# Altium schematic sheet Qbot3.SchDoc
size A3
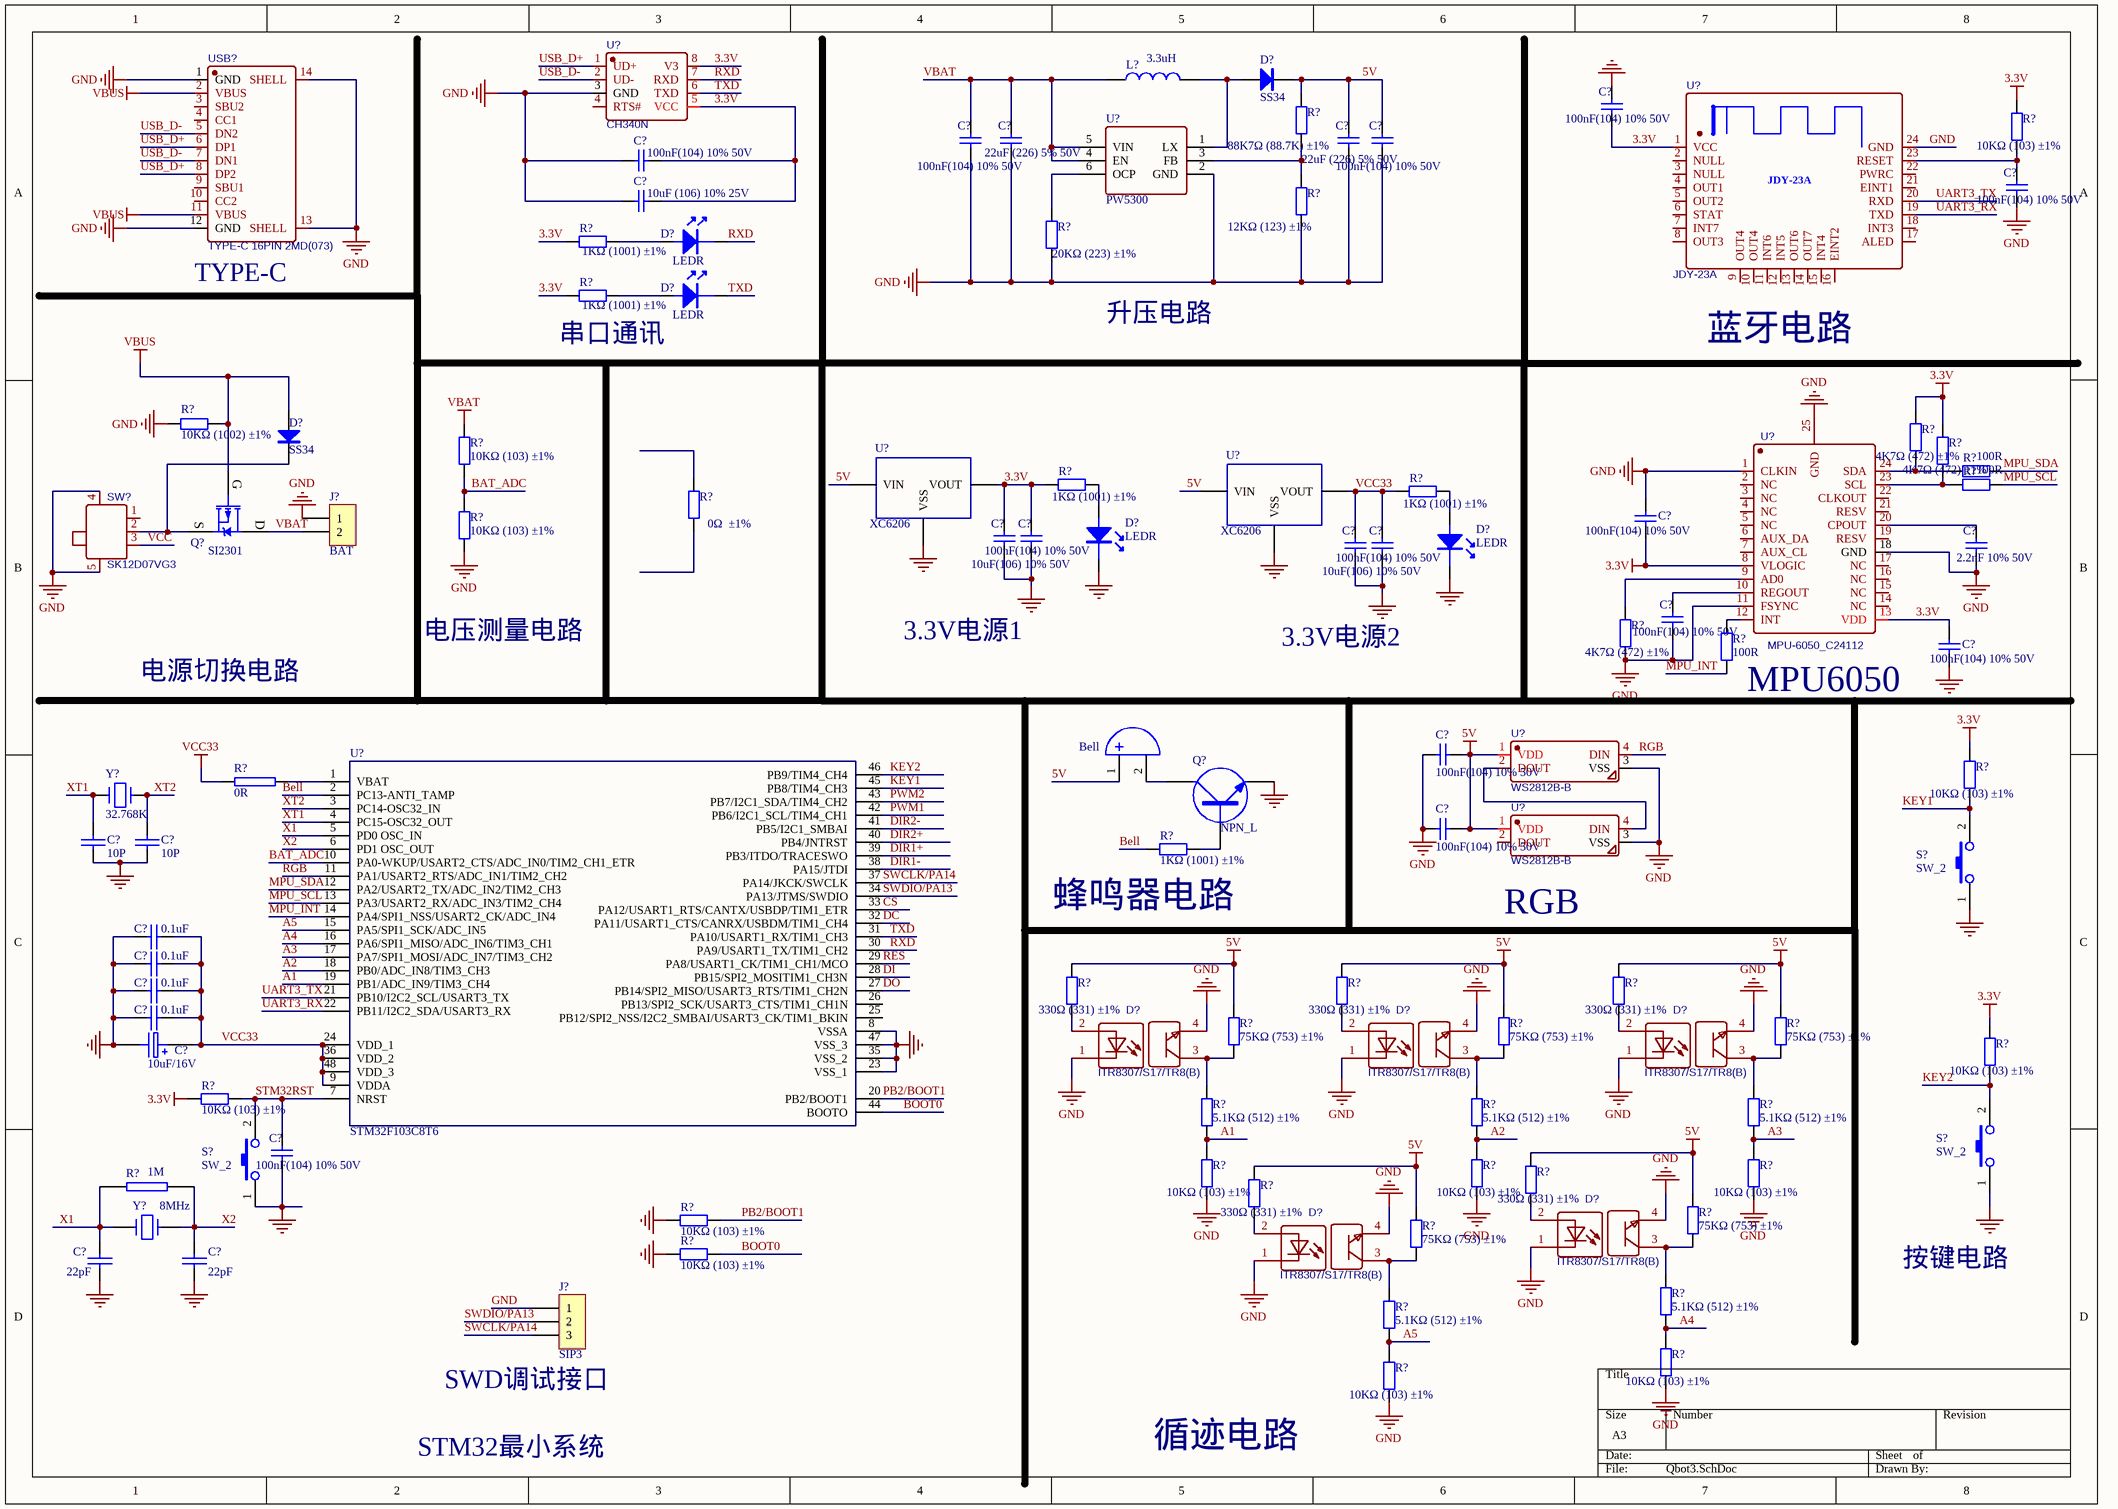
[diagram p0: Qbot3.SchDoc]

## Parts
(Parts that share a designator on the sheet are numbered #1, #2 ... from top to bottom, then left to right.)
C?#1  100nF(104) 10% 50V  [LC-0805_C]
C?#2  100nF(104) 10% 50V  [LC-0805_C]
C?#3  100nF(104) 10% 50V  [LC-0805_C]
C?#4  100nF(104) 10% 50V  [LC-0805_C]
C?#5  100nF(104) 10% 50V  [LC-0805_C]
C?#6  22uF (226) 5% 50V  [LC-0805_C]
C?#7  22uF (226) 5% 50V  [LC-0805_C]
C?#8  10uF (106) 10% 25V  [LC-0805_C]
C?#9  10uF(106) 10% 50V  [LC-0805_C]
C?#10  100nF(104) 10% 50V  [LC-0805_C]
C?#11  10uF(106) 10% 50V  [LC-0805_C]
C?#12  100nF(104) 10% 50V  [LC-0805_C]
C?#13  2.2nF 10% 50V  [LC-0805_C]
C?#14  100nF(104) 10% 50V  [LC-0805_C]
C?#15  100nF(104) 10% 50V  [LC-0805_C]
C?#16  100nF(104) 10% 50V  [LC-0805_C]
C?#17  100nF(104) 10% 50V  [LC-0805_C]
C?#18  100nF(104) 10% 50V  [LC-0805_C]
C?#19  10P  [LC-0805_C]
C?#20  10P  [LC-0805_C]
C?#21  0.1uF  [LC-0805_C]
C?#22  0.1uF  [LC-0805_C]
C?#23  0.1uF  [LC-0805_C]
C?#24  0.1uF  [LC-0805_C]
C?#25  10uF/16V  [LC-0805_C]
C?#26  100nF(104) 10% 50V  [LC-0805_C]
C?#27  22pF  [LC-0805_C]
C?#28  22pF  [LC-0805_C]
D?#1  SS34  [SMA]
D?#2  LEDR  [LED0805G]
D?#3  LEDR  [LED0805G]
D?#4  SS34  [SMA]
D?#5  LEDR  [LED0805G]
D?#6  LEDR  [LED0805G]
D?#7  ITR8307/S17/TR8(B)  [OPTO-SMD_ITR8307-S17-TR8-B-BL]
D?#8  ITR8307/S17/TR8(B)  [OPTO-SMD_ITR8307-S17-TR8-B-BL]
D?#9  ITR8307/S17/TR8(B)  [OPTO-SMD_ITR8307-S17-TR8-B-BL]
D?#10  ITR8307/S17/TR8(B)  [OPTO-SMD_ITR8307-S17-TR8-B-BL]
D?#11  ITR8307/S17/TR8(B)  [OPTO-SMD_ITR8307-S17-TR8-B-BL]
J?#1  BAT  [XH2.54-LI-2P]
J?#2  SIP3  [HDR2.54-WI-3P]
L?  3.3uH  [IND-SMD_L4.6-W4.1]
LS?  Bell  [BELL]
Q?#1  SI2301  [SOT23]
Q?#2  NPN_L  [SOT-23_S8050]
R?#1  88K7Ω (88.7K) ±1%  [LC-0805_R]
R?#2  10KΩ (103) ±1%  [LC-0805_R]
R?#3  12KΩ (123) ±1%  [LC-0805_R]
R?#4  20KΩ (223) ±1%  [LC-0805_R]
R?#5  1KΩ (1001) ±1%  [LC-0805_R]
R?#6  1KΩ (1001) ±1%  [LC-0805_R]
R?#7  10KΩ (1002) ±1%  [LC-0805_R]
R?#8  4K7Ω (472) ±1%  [LC-0805_R]
R?#9  10KΩ (103) ±1%  [LC-0805_R]
R?#10  4K7Ω (472) ±1%  [LC-0805_R]
R?#11  100R  [LC-0805_R]
R?#12  1KΩ (1001) ±1%  [LC-0805_R]
R?#13  100R  [LC-0805_R]
R?#14  1KΩ (1001) ±1%  [LC-0805_R]
R?#15  0Ω  ±1%  [LC-0805_R]
R?#16  10KΩ (103) ±1%  [LC-0805_R]
R?#17  4K7Ω (472) ±1%  [LC-0805_R]
R?#18  100R  [LC-0805_R]
R?#19  0R  [LC-0805_R]
R?#20  10KΩ (103) ±1%  [LC-0805_R]
R?#21  1KΩ (1001) ±1%  [LC-0805_R]
R?#22  330Ω (331) ±1%  [LC-0805_R]
R?#23  330Ω (331) ±1%  [LC-0805_R]
R?#24  330Ω (331) ±1%  [LC-0805_R]
R?#25  75KΩ (753) ±1%  [LC-0805_R]
R?#26  75KΩ (753) ±1%  [LC-0805_R]
R?#27  75KΩ (753) ±1%  [LC-0805_R]
R?#28  10KΩ (103) ±1%  [LC-0805_R]
R?#29  10KΩ (103) ±1%  [LC-0805_R]
R?#30  5.1KΩ (512) ±1%  [LC-0805_R]
R?#31  5.1KΩ (512) ±1%  [LC-0805_R]
R?#32  5.1KΩ (512) ±1%  [LC-0805_R]
R?#33  1M  [LC-0805_R]
R?#34  10KΩ (103) ±1%  [LC-0805_R]
R?#35  10KΩ (103) ±1%  [LC-0805_R]
R?#36  10KΩ (103) ±1%  [LC-0805_R]
R?#37  330Ω (331) ±1%  [LC-0805_R]
R?#38  330Ω (331) ±1%  [LC-0805_R]
R?#39  10KΩ (103) ±1%  [LC-0805_R]
R?#40  75KΩ (753) ±1%  [LC-0805_R]
R?#41  75KΩ (753) ±1%  [LC-0805_R]
R?#42  10KΩ (103) ±1%  [LC-0805_R]
R?#43  5.1KΩ (512) ±1%  [LC-0805_R]
R?#44  5.1KΩ (512) ±1%  [LC-0805_R]
R?#45  10KΩ (103) ±1%  [LC-0805_R]
R?#46  10KΩ (103) ±1%  [LC-0805_R]
S?#1  SW_2  [TSW SMD-3*6*2.5]
S?#2  SW_2  [TSW SMD-3*6*2.5]
S?#3  SW_2  [TSW SMD-3*6*2.5]
SW?  SK12D07VG3  [SW-TH_SK-12D07-VG3]
U?#1  CH340N  [SOP8]
U?#2  PW5300  [SOT23-6L]
U?#3  JDY-23A  [JDY-23A]
U?#4  XC6206  [SOT-23_TL431]
U?#5  XC6206  [SOT-23_TL431]
U?#6  MPU-6050_C24112  [QFN24]
U?#7  STM32F103C8T6  [STM32F103C8T6_LQFP48]
U?#8  WS2812B-B  [LED-SMD_4P-L5.0-W5.0-TL_WS2812B-B]
U?#9  WS2812B-B  [LED-SMD_4P-L5.0-W5.0-TL_WS2812B-B]
USB?  TYPE-C 16PIN 2MD(073)  [USB-C-SMD_TYPE-C-6PIN-2MD-073]
Y?#1  32.768K  [OSC-3x10-WI-A]
Y?#2  8MHz  [OSC HC-49S]

## Nets
3.3V: C?#1.2 C?#5.1 C?#8.1 C?#9.1 C?#10.1 C?#14.1 C?#16.2 R?#2.1 R?#5.1 R?#6.1 R?#8.1 R?#10.1 R?#12.1 R?#20.1 R?#28.1 R?#29.2 U?#1.5(VCC) U?#1.8(V3) U?#3.1(VCC) U?#4.2(VOUT) U?#6.8(VLOGIC) U?#6.13(VDD)
5V: C?#3.1 C?#7.2 C?#17.1 C?#18.1 D?#1.2(K) LS?.1(A) R?#1.2 R?#22.2 R?#23.2 R?#24.2 R?#25.1 R?#26.1 R?#27.1 R?#37.2 R?#38.2 R?#40.1 R?#41.1 U?#4.3(VIN) U?#5.3(VIN) U?#8.1(VDD) U?#9.1(VDD)
GND: C?#1.1 C?#2.2 C?#3.2 C?#4.2 C?#5.2 C?#6.1 C?#7.1 C?#8.2 C?#9.2 C?#10.2 C?#11.2 C?#12.2 C?#13.2 C?#14.2 C?#15.2 C?#16.1 C?#17.2 C?#18.2 C?#19.1 C?#20.1 C?#21.2 C?#22.2 C?#23.2 C?#24.2 C?#25.2 C?#26.2 C?#27.2 C?#28.2 D?#5.2 D?#6.2 D?#7.1 D?#7.4 D?#8.1 D?#8.4 D?#9.1 D?#9.4 D?#10.1 D?#10.4 D?#11.1 D?#11.4 J?#1.1 J?#2.1 Q?#2.2(E) R?#3.1 R?#4.1 R?#7.1 R?#16.2 R?#17.2 R?#34.2 R?#35.2 R?#36.2 R?#39.1 R?#42.1 R?#45.2 R?#46.2 S?#1.1 S?#2.1 S?#3.1 SW?.4 SW?.5 U?#1.3(GND) U?#2.2(GND) U?#3.24(GND) U?#4.1(VSS) U?#5.1(VSS) U?#6.1(CLKIN) U?#6.11(FSYNC) U?#6.18(GND) U?#6.25(GND) U?#7.8(VSSA) U?#7.23(VSS_1) U?#7.35(VSS_2) U?#7.47(VSS_3) U?#8.3(VSS) U?#9.3(VSS) USB?.1(GND) USB?.12(GND) USB?.13(SHELL) USB?.14(SHELL)
VBAT: C?#2.1 C?#6.2 J?#1.2 L?.1 Q?#1.3(D) R?#9.1 U?#2.4(EN) U?#2.5(VIN)
VBUS: D?#4.1(A) Q?#1.1(G) R?#7.2 USB?.2(VBUS) USB?.11(VBUS)
VCC33: C?#11.1 C?#12.1 C?#21.1 C?#22.1 C?#23.1 C?#24.1 C?#25.1 R?#14.1 R?#19.1 U?#5.2(VOUT) U?#7.9(VDDA) U?#7.24(VDD_1) U?#7.36(VDD_2) U?#7.48(VDD_3)
A1: R?#30.1 R?#34.1 U?#7.19(PB1/ADC_IN9/TIM3_CH4)
A2: R?#31.1 R?#35.1 U?#7.18(PB0/ADC_IN8/TIM3_CH3)
A3: R?#32.1 R?#36.1 U?#7.17(PA7/SPI1_MOSI/ADC_IN7/TIM3_CH2)
A4: R?#43.1 R?#45.1 U?#7.16(PA6/SPI1_MISO/ADC_IN6/TIM3_CH1)
A5: R?#44.1 R?#46.1 U?#7.15(PA5/SPI1_SCK/ADC_IN5)
BAT_ADC: R?#9.2 R?#16.1 U?#7.10(PA0-WKUP/USART2_CTS/ADC_IN0/TIM2_CH1_ETR)
Bell: R?#21.1 U?#7.2(PC13-ANTI_TAMP)
BOOT0: R?#42.2 U?#7.44(BOOTO)
CS: U?#7.33(PA12/USART1_RTS/CANTX/USBDP/TIM1_ETR)
DC: U?#7.32(PA11/USART1_CTS/CANRX/USBDM/TIM1_CH4)
DI: U?#7.28(PB15/SPI2_MOSITIM1_CH3N)
DIR1+: U?#7.39(PB3/ITDO/TRACESWO)
DIR1-: U?#7.38(PA15/JTDI)
DIR2+: U?#7.40(PB4/JNTRST)
DIR2-: U?#7.41(PB5/I2C1_SMBAI)
DO: U?#7.27(PB14/SPI2_MISO/USART3_RTS/TIM1_CH2N)
KEY1: R?#20.2 S?#1.2 U?#7.45(PB8/TIM4_CH3)
KEY2: R?#28.2 S?#2.2 U?#7.46(PB9/TIM4_CH4)
MPU_INT: R?#18.1 U?#7.14(PA4/SPI1_NSS/USART2_CK/ADC_IN4)
MPU_SCL: R?#13.2 U?#7.13(PA3/USART2_RX/ADC_IN3/TIM2_CH4)
MPU_SDA: R?#11.2 U?#7.12(PA2/USART2_TX/ADC_IN2/TIM2_CH3)
PB2/BOOT1: R?#39.2 U?#7.20(PB2/BOOT1)
PWM1: U?#7.42(PB6/I2C1_SCL/TIM4_CH1)
PWM2: U?#7.43(PB7/I2C1_SDA/TIM4_CH2)
RES: U?#7.29(PA8/USART1_CK/TIM1_CH1/MCO)
RGB: U?#7.11(PA1/USART2_RTS/ADC_IN1/TIM2_CH2) U?#8.4(DIN)
RXD: D?#2.2 U?#1.7(RXD) U?#7.30(PA9/USART1_TX/TIM1_CH2)
STM32RST: C?#26.1 R?#29.1 S?#3.2 U?#7.7(NRST)
SWCLK/PA14: J?#2.3 U?#7.37(PA14/JKCK/SWCLK)
SWDIO/PA13: J?#2.2 U?#7.34(PA13/JTMS/SWDIO)
TXD: D?#3.2 U?#1.6(TXD) U?#7.31(PA10/USART1_RX/TIM1_CH3)
UART3_RX: U?#3.19(TXD) U?#7.22(PB11/I2C2_SDA/USART3_RX)
UART3_TX: U?#3.20(RXD) U?#7.21(PB10/I2C2_SCL/USART3_TX)
USB_D+: U?#1.1(UD+) USB?.6(DP1) USB?.8(DP2)
USB_D-: U?#1.2(UD-) USB?.5(DN2) USB?.7(DN1)
VCC: SW?.3
X1: C?#27.1 R?#33.1 U?#7.5(PD0_OSC_IN) Y?#2.1
X2: C?#28.1 R?#33.2 U?#7.6(PD1_OSC_OUT) Y?#2.2
XT1: C?#19.2 U?#7.4(PC15-OSC32_OUT) Y?#1.2
XT2: C?#20.2 U?#7.3(PC14-OSC32_IN) Y?#1.1
NetC?#4_1: C?#4.1 R?#2.2 U?#3.23(RESET)
NetC?#13_1: C?#13.1 U?#6.20(CPOUT)
NetC?#15_1: C?#15.1 U?#6.10(REGOUT)
NetD?#1_1: D?#1.1(A) L?.2 U?#2.1(LX)
NetD?#2_1: D?#2.1 R?#5.2
NetD?#3_1: D?#3.1 R?#6.2
NetD?#4_2: D?#4.2(K) Q?#1.2(S) SW?.2
NetD?#5_1: D?#5.1 R?#12.2
NetD?#6_1: D?#6.1 R?#14.2
NetD?#7_2: D?#7.2 R?#22.1
NetD?#7_3: D?#7.3 R?#25.2 R?#30.2
NetD?#8_2: D?#8.2 R?#23.1
NetD?#8_3: D?#8.3 R?#26.2 R?#31.2
NetD?#9_2: D?#9.2 R?#24.1
NetD?#9_3: D?#9.3 R?#27.2 R?#32.2
NetD?#10_2: D?#10.2 R?#37.1
NetD?#10_3: D?#10.3 R?#40.2 R?#43.2
NetD?#11_2: D?#11.2 R?#38.1
NetD?#11_3: D?#11.3 R?#41.2 R?#44.2
NetLS?_2: LS?.2(B) Q?#2.3(C)
NetQ?#2_1: Q?#2.1(B) R?#21.2
NetR?#1_1: R?#1.1 R?#3.2 U?#2.3(FB)
NetR?#4_2: R?#4.2 U?#2.6(OCP)
NetR?#8_2: R?#8.2 R?#11.1 U?#6.24(SDA)
NetR?#10_2: R?#10.2 R?#13.1 U?#6.23(SCL)
NetR?#17_1: R?#17.1 U?#6.9(AD0)
NetR?#18_2: R?#18.2 U?#6.12(INT)
NetR?#19_2: R?#19.2 U?#7.1(VBAT)
NetU?#8_2: U?#8.2(DOUT) U?#9.4(DIN)

Not connected (* = marked no-connect by the designer): R?#15 1 2; SW? 1; U?#1 4(RTS#); U?#3 2(NULL) 3(NULL) 4(OUT1) 5(OUT2) 6(STAT) 7(INT7) 8(OUT3) 9(OUT4) 10(OUT4) 11(INT6) 12(INT5) 13(OUT6) 14(OUT7) 15(INT4) 16(EINT2) 17(ALED) 18(INT3) 21(EINT1) 22(PWRC); U?#6 2(NC) 3(NC) 4(NC) 5(NC) 6(AUX_DA) 7(AUX_CL) 14(NC) 15(NC) 16(NC) 17(NC) 19(RESV) 21(RESV) 22(CLKOUT); U?#7 25(PB12/SPI2_NSS/I2C2_SMBAI/USART3_CK/TIM1_BKIN) 26(PB13/SPI2_SCK/USART3_CTS/TIM1_CH1N); U?#9 2(DOUT); USB? 3(SBU2) 4(CC1) 9(SBU1) 10(CC2)

## Notes on the sheet
- (near USB?) TYPE-C
- (near R?#6) 串口通讯
- 升压电路
- (near U?#3) 蓝牙电路
- 电压测量电路
- 3.3V电源1
- 3.3V电源2
- 电源切换电路
- (near R?#18) MPU6050
- (near R?#21) 蜂鸣器电路
- (near U?#9) RGB
- 按键电路
- (near J?#2) SWD调试接口
- STM32最小系统
- 循迹电路

## Library data of the parts
C?#1-C?#5 C?#9-C?#18 C?#26 = 0805 100nF(104) 10% 50V: 贴片电容; ComponentLink1Description: 供应商链接; ComponentLink1URL: http://www.szlcsc.com/product/details_50686.html; Package: 0805; Supplier: LC; SuppliersPartNumber: C49678
C?#6 C?#7 = 0805 22pF (220) 5% 50V: 贴片电容; ComponentLink1Description: 供应商链接; ComponentLink1URL: http://www.szlcsc.com/product/details_2156.html; Package: 0805; Supplier: LC; SuppliersPartNumber: C1804
C?#8 = 0805 10uF (106) 10% 25V: 贴片电容; ComponentLink1Description: 供应商链接; ComponentLink1URL: http://www.szlcsc.com/product/details_16532.html; Package: 0805; Supplier: LC; SuppliersPartNumber: C15850
C?#19 C?#20 = CAP
C?#21-C?#24 C?#27 C?#28 = CAP: Capacitor
C?#25 = ELECTRO1: Electrolytic Capacitor
D?#1 D?#4 = SS34: 肖特基二极管; 版权归属: 源创客; 属性: 40V/3A; BOM名称: 肖特基二极管; 学习资源: www.ooocke.com
D?#2 D?#3 D?#5 D?#6 = LED
D?#7-D?#11 = ITR8307/S17/TR8(B): BOM_Manufacturer: EVERLIGHT; BOM_Supplier: LCSC; BOM_Manufacturer Part: ITR8307/S17/TR8(B); BOM_Supplier Part: C81632; BOM_JLCPCB Part Class: Extended Part; spicePre: K; spiceSymbolName: ITR8307/S17/TR8(B)
J?#1 = SIP2: jointbar
J?#2 = SIP3: jointbar
L? = L: 小功率贴片电感; 版权归属: 源创客; BOM名称: 小功率贴片电感; 学习资源: www.ooocke.com
LS? = Bell: Electrical Bell; Published: 24-Mar-1999; LatestRevisionDate: 17-Jul-2002; LatestRevisionNote: Re-released for DXP Platform.; Publisher: Altium Limited
Q?#1 = SI2301: P沟道场效应管; 版权归属: 源创客; BOM名称: P沟道场效应管; 学习资源: www.ooocke.com
R?#1-R?#6 R?#8-R?#18 R?#20-R?#32 R?#34-R?#46 = 0805 1KΩ (1001) 1%: 贴片电阻; ComponentLink1Description: 供应商链接; ComponentLink1URL: http://www.szlcsc.com/product/details_18201.html; Package: 0805; Supplier: LC; SuppliersPartNumber: C17513
R?#7 = 0805 10KΩ (1002) 1%: 贴片电阻; ComponentLink1Description: 供应商链接; ComponentLink1URL: http://www.szlcsc.com/product/details_18102.html; Package: 0805; Supplier: LC; SuppliersPartNumber: C17414
R?#19 = RES
R?#33 = RES2
SW? = SK12D07VG6: BOM_Manufacturer: SHOU HAN(首韩); Contributor: LCSC; BOM_Supplier: LCSC; BOM_Supplier Part: C2681575; BOM_Manufacturer Part: SK12D07VG6; BOM_JLCPCB Part Class: Extended Part; spicePre: S; spiceSymbolName: SK12D07VG6
U?#1 = CH340N: BOM_Manufacturer: WCH(Jiangsu Qin Heng); subpart_no: 1; Contributor: LCSC; BOM_Supplier: LCSC; BOM_Supplier Part: C506813; BOM_Manufacturer Part: CH340N; BOM_JLCPCB Part Class: Extended Part; spicePre: U; spiceSymbolName: CH340N
U?#3 = JDY-23A: BOM_Manufacturer: TTCIOTSDK; BOM_Manufacturer Part: HY-40R204P; Contributor: LCSC; BOM_Supplier: LCSC; BOM_Supplier Part: C172803; BOM_JLCPCB Part Class: Extended Part; spicePre: U; spiceSymbolName: HY-40R204P
U?#6 = MPU-6050_C24112: BOM_Manufacturer: InvenSense; sourceId: 1T5FDZYC8; timeStamp: 1462265206; BOM_Supplier: LCSC; BOM_Manufacturer Part: MPU-6050; BOM_Supplier Part: C24112; BOM_JLCPCB Part Class: Basic Part; spicePre: U; spiceSymbolName: MPU-6050_C24112
U?#8 U?#9 = WS2812B-B: BOM_Manufacturer: Worldsemi; Contributor: LCSC; BOM_Supplier: LCSC; BOM_Manufacturer Part: WS2812B-B; BOM_Supplier Part: C114586; BOM_JLCPCB Part Class: Extended Part; spicePre: L; spiceSymbolName: WS2812B-B
USB? = TYPE-C 16PIN 2MD(073): BOM_Manufacturer: SHOU HAN(首韩); Contributor: LCSC; BOM_Supplier: LCSC; BOM_Supplier Part: C2765186; BOM_Manufacturer Part: TYPE-C 16PIN 2MD(073); BOM_JLCPCB Part Class: Extended Part; spicePre: U; spiceSymbolName: TYPE-C 16PIN 2MD(073)
Y?#1 = CRYSTAL: 晶振
Y?#2 = XTAL: Crystal